# Altium schematic sheet interface.SchDoc
size A4; DocumentNumber: 5; SheetNumber: 4
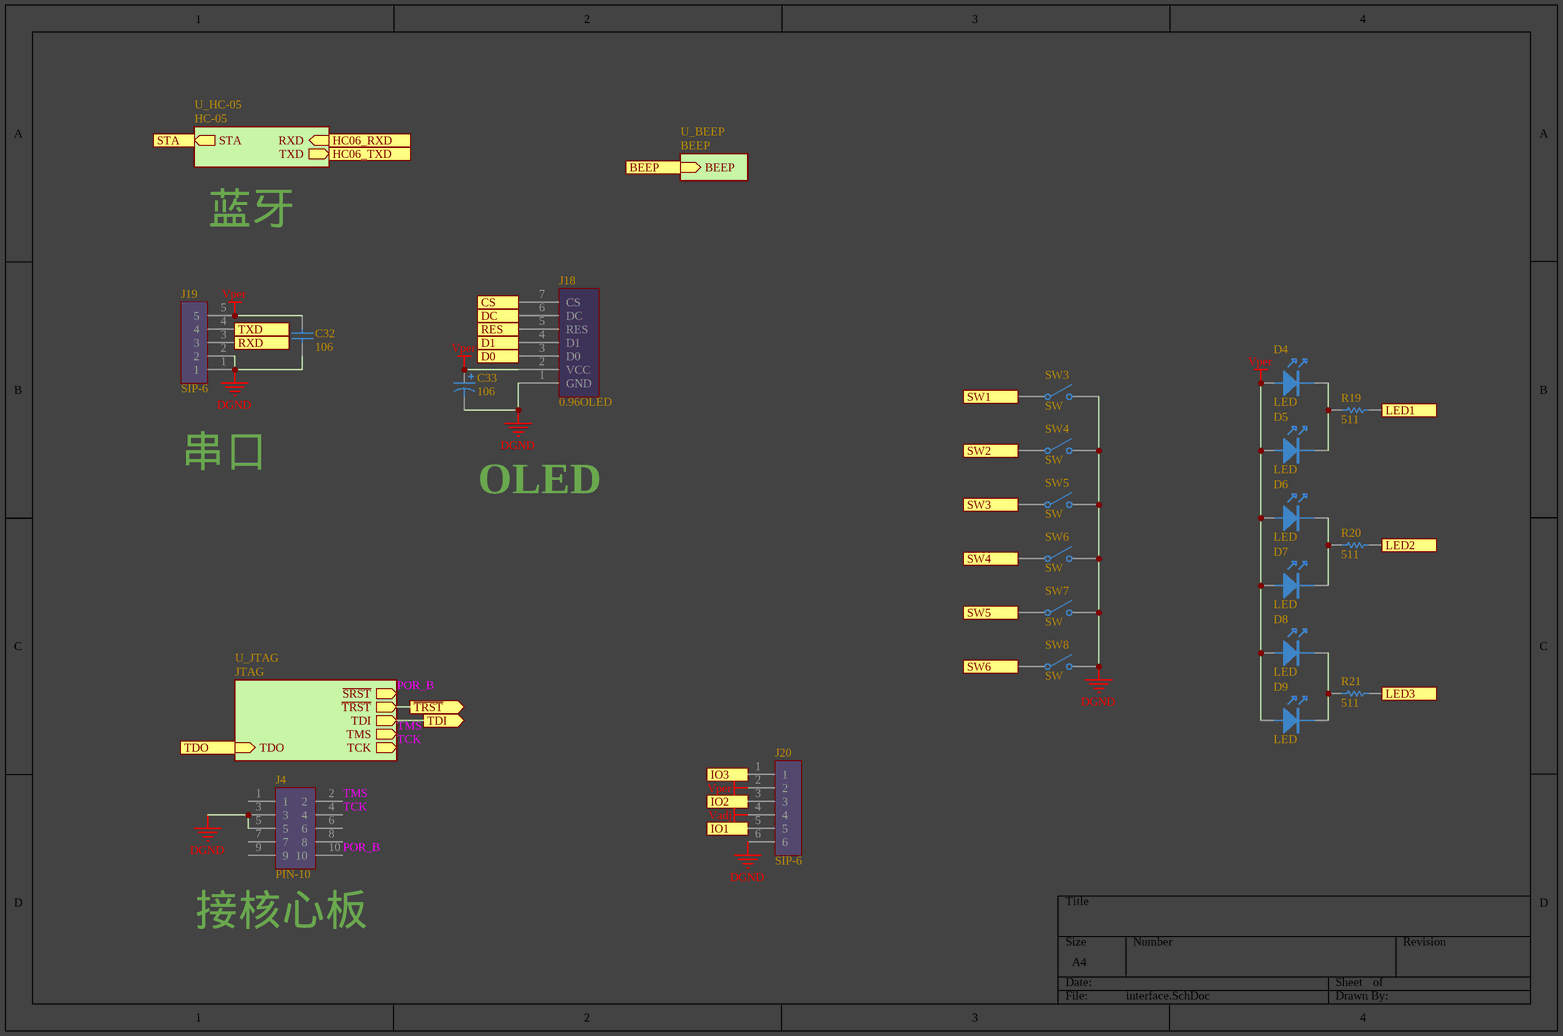
[diagram p0: interface.SchDoc]

## Parts
C32  106  [C0603]
C33  106  [3216-ce]
D4  LED  [LED-SMD_L1.7-W0.6-RD]
D5  LED  [LED-SMD_L1.7-W0.6-RD]
D6  LED  [LED-SMD_L1.7-W0.6-RD]
D7  LED  [LED-SMD_L1.7-W0.6-RD]
D8  LED  [LED-SMD_L1.7-W0.6-RD]
D9  LED  [LED-SMD_L1.7-W0.6-RD]
J4  PIN-10  [JTAG_10P]
J18  0.96OLED  [OLED 0.96]
J19  SIP-6  [2.54排针1X5]
J20  SIP-6  [2.54简易牛角座6P]
R19  511  [R0402]
R20  511  [R0402]
R21  511  [R0402]
SW3  SW  [轻触开关6.2*6.2(5p) SMD]
SW4  SW  [轻触开关6.2*6.2(5p) SMD]
SW5  SW  [轻触开关6.2*6.2(5p) SMD]
SW6  SW  [轻触开关6.2*6.2(5p) SMD]
SW7  SW  [轻触开关6.2*6.2(5p) SMD]
SW8  SW  [轻触开关6.2*6.2(5p) SMD]

## Sub-sheets
U_BEEP = BEEP: BEEP (in)
U_HC-05 = HC-05: TXD (out), RXD (in), STA (out)
U_JTAG = JTAG: TDO (in), ~{SRST} (out), ~{TRST} (out), TDI (out), TMS (out), TCK (out)

## Ports
BEEP (in), CS (in), D0 (in), D1 (in), DC (in), HC06_RXD (in), HC06_TXD (out), IO1, IO2, IO3, LED1 (in), LED2 (in), LED3 (in), RES (in), RXD (in), STA (out), SW1 (out), SW2 (out), SW3 (out), SW4 (out), SW5 (out), SW6 (out), TDI (out), TDO (in), TXD (out), ~{TRST} (out)

## Nets
DGND: C32.1 C33.2 J4.3 J4.5 J18.1(GND) J19.1 J19.2 J20.6 SW3.2(NO) SW4.2(NO) SW5.2(NO) SW6.2(NO) SW7.2(NO) SW8.2(NO)
Vadj: J20.4
Vper: C32.2 C33.1 D4.A D5.A D6.A D7.A D8.A D9.A J18.2(VCC) J19.5 J20.2
~{TRST}: port ~{TRST}, sheet U_JTAG/~{TRST}
BEEP: port BEEP, sheet U_BEEP/BEEP
CS: J18.7(CS) ; port CS
D0: J18.3(D0) ; port D0
D1: J18.4(D1) ; port D1
DC: J18.6(DC) ; port DC
HC06_RXD: port HC06_RXD, sheet U_HC-05/RXD
HC06_TXD: port HC06_TXD, sheet U_HC-05/TXD
IO1: J20.5 ; port IO1
IO2: J20.3 ; port IO2
IO3: J20.1 ; port IO3
LED1: R19.1 ; port LED1
LED2: R20.1 ; port LED2
LED3: R21.1 ; port LED3
POR_B: J4.10 ; sheet U_JTAG/~{SRST}
RES: J18.5(RES) ; port RES
RXD: J19.3 ; port RXD
STA: port STA, sheet U_HC-05/STA
SW1: SW3.1(COMMON) ; port SW1
SW2: SW4.1(COMMON) ; port SW2
SW3: SW5.1(COMMON) ; port SW3
SW4: SW6.1(COMMON) ; port SW4
SW5: SW7.1(COMMON) ; port SW5
SW6: SW8.1(COMMON) ; port SW6
TCK: J4.4 ; sheet U_JTAG/TCK
TDI: port TDI, sheet U_JTAG/TDI
TDO: port TDO, sheet U_JTAG/TDO
TMS: J4.2 ; sheet U_JTAG/TMS
TXD: J19.4 ; port TXD
NetD4_K: D4.K D5.K R19.2
NetD6_K: D6.K D7.K R20.2
NetD8_K: D8.K D9.K R21.2

Not connected (* = marked no-connect by the designer): J4 1 6 7 8 9

## Notes on the sheet
- 蓝牙
- 串口
- OLED
- (near J4) 接核心板

## Library data of the parts
C32 = 电容: Capacitor; Value: 22pF; Published: 8-Jun-2000; LatestRevisionDate: 17-Jul-2002; LatestRevisionNote: Re-released for DXP Platform.; PackageReference: RAD-0.3; Publisher: Altium Limited; PackageDescription: Radial Cap, Thru-Hole; 2 Leads; 0.3 in Pin Spacing
C33 = 电解电容: Polarized Capacitor (Axial); Value: 100pF; Published: 8-Jun-2000; LatestRevisionDate: 17-Jul-2002; LatestRevisionNote: Re-released for DXP Platform.; PackageReference: POLAR0.8; Publisher: Altium Limited; PackageDescription: Polarized Capacitor; 2 Leads
J18 = OLED_SPI
J19 = SIP-5
R19-R21 = 电阻: Resistor; Value: 150R; Published: 8-Jun-2000; LatestRevisionDate: 17-Jul-2002; LatestRevisionNote: Re-released for DXP Platform.; PackageReference: AXIAL-0.3; Publisher: Altium Limited; PackageDescription: Axial Device, Thru-Hole; 2 Leads; 0.3 in Pin Spacing
SW3-SW8 = Switch: Single-Pole, Single-Throw Switch